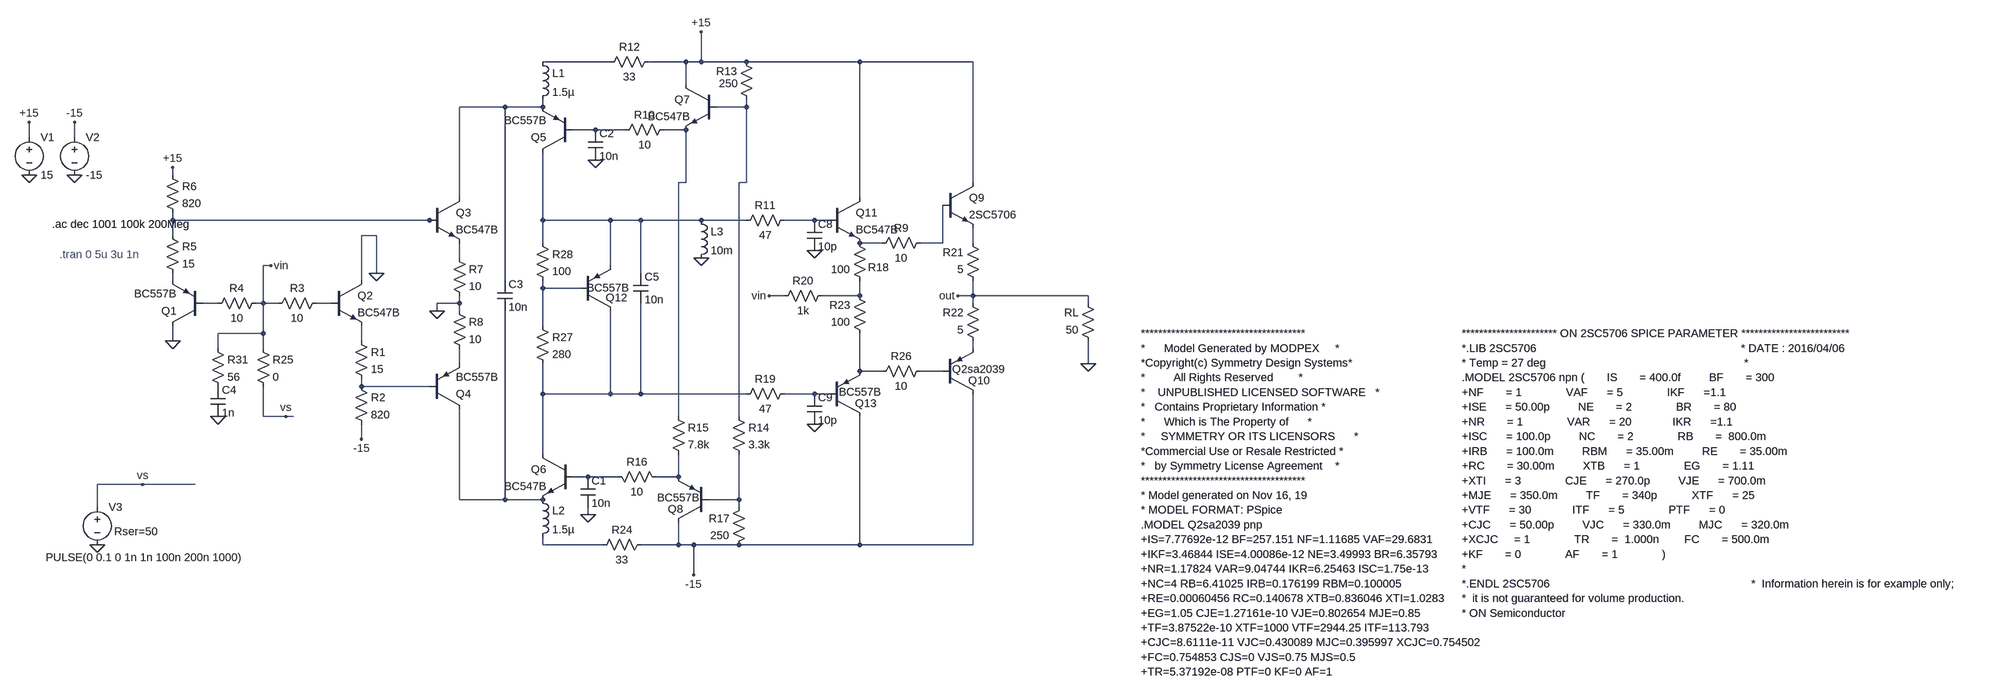
[diagram p0: schematic wideband_amp.asc]
wideband_amp.asc, the LTspice schematic file:
Version 4
SHEET 1 3884 932
WIRE 640 -304 496 -304
WIRE 800 -304 720 -304
WIRE 832 -304 832 -368
WIRE 832 -304 800 -304
WIRE 928 -304 832 -304
WIRE 1168 -304 928 -304
WIRE 1408 -304 1168 -304
WIRE 800 -256 800 -304
WIRE 416 -208 320 -208
WIRE 496 -208 496 -224
WIRE 496 -208 416 -208
WIRE 928 -208 928 -224
WIRE 928 -208 864 -208
WIRE 608 -160 560 -160
WIRE 672 -160 608 -160
WIRE 800 -160 752 -160
WIRE -592 -144 -592 -176
WIRE -496 -144 -496 -176
WIRE -288 -64 -288 -80
WIRE 800 -48 800 -160
WIRE 800 -48 784 -48
WIRE 928 -48 928 -208
WIRE 928 -48 912 -48
WIRE 1408 -48 1408 -304
WIRE 320 -16 320 -208
WIRE 1168 -16 1168 -304
WIRE -288 32 -288 16
WIRE 256 32 -288 32
WIRE 272 32 256 32
WIRE 496 32 496 -112
WIRE 640 32 496 32
WIRE 704 32 640 32
WIRE 832 32 704 32
WIRE 928 32 832 32
WIRE 1072 32 1008 32
WIRE 1104 32 1072 32
WIRE -288 64 -288 32
WIRE 144 64 112 64
WIRE 496 80 496 32
WIRE 1216 80 1168 80
WIRE 1344 80 1344 0
WIRE 1344 80 1296 80
WIRE 1408 80 1408 48
WIRE 320 112 320 80
WIRE -80 128 -96 128
WIRE 640 128 640 32
WIRE 144 144 144 64
WIRE 704 144 704 32
WIRE -288 160 -288 144
WIRE 112 160 112 64
WIRE 416 160 416 -208
WIRE 496 176 496 160
WIRE 576 176 496 176
WIRE 1008 192 976 192
WIRE 1168 192 1168 160
WIRE 1168 192 1088 192
WIRE 1408 192 1408 160
WIRE 1408 192 1376 192
WIRE 1712 192 1408 192
WIRE -192 208 -224 208
WIRE -96 208 -96 128
WIRE -96 208 -112 208
WIRE -64 208 -96 208
WIRE 48 208 16 208
WIRE 320 208 320 192
WIRE 320 208 272 208
WIRE 1408 208 1408 192
WIRE 1712 208 1712 192
WIRE 272 224 272 208
WIRE 320 224 320 208
WIRE 496 256 496 176
WIRE -96 272 -96 208
WIRE -96 272 -192 272
WIRE -288 288 -288 256
WIRE 112 288 112 256
WIRE -192 304 -192 272
WIRE -96 304 -96 272
WIRE 1408 304 1408 288
WIRE 320 336 320 304
WIRE 1712 336 1712 288
WIRE 1168 352 1168 272
WIRE 1216 352 1168 352
WIRE 1344 352 1296 352
WIRE 112 384 112 368
WIRE 256 384 112 384
WIRE 496 400 496 336
WIRE 640 400 640 224
WIRE 640 400 496 400
WIRE 704 400 704 208
WIRE 704 400 640 400
WIRE 928 400 704 400
WIRE 1072 400 1008 400
WIRE 1104 400 1072 400
WIRE -96 448 -96 384
WIRE -48 448 -96 448
WIRE -32 448 -48 448
WIRE 784 448 784 -48
WIRE 912 448 912 -48
WIRE 112 496 112 464
WIRE 496 528 496 400
WIRE 592 576 560 576
WIRE 656 576 592 576
WIRE 784 576 784 528
WIRE 784 576 736 576
WIRE -352 592 -448 592
WIRE -240 592 -352 592
WIRE 320 624 320 432
WIRE 416 624 416 224
WIRE 416 624 320 624
WIRE 496 624 416 624
WIRE 912 624 912 528
WIRE 912 624 848 624
WIRE -448 640 -448 592
WIRE 912 640 912 624
WIRE 592 656 592 640
WIRE 496 720 496 704
WIRE 624 720 496 720
WIRE 784 720 784 672
WIRE 784 720 704 720
WIRE 816 720 784 720
WIRE 912 720 816 720
WIRE 1168 720 1168 448
WIRE 1168 720 912 720
WIRE 1408 720 1408 400
WIRE 1408 720 1168 720
WIRE 816 784 816 720
FLAG -592 -64 0
FLAG -496 -64 0
FLAG -592 -176 +15
FLAG -496 -176 -15
FLAG 112 496 -15
FLAG 144 144 0
FLAG -288 288 0
FLAG -288 -80 +15
FLAG 272 224 0
FLAG 592 656 0
FLAG 832 -368 +15
FLAG 816 784 -15
FLAG 1712 336 0
FLAG 1376 192 out
FLAG 608 -96 0
FLAG -80 128 vin
FLAG -448 720 0
FLAG 1072 96 0
FLAG 1072 464 0
FLAG 832 112 0
FLAG -192 448 0
FLAG -48 448 vs
FLAG -352 592 vs
FLAG 976 192 vin
DATAFLAG -96 32 "$"
DATAFLAG 208 384 "$"
DATAFLAG 864 624 "$"
DATAFLAG 608 576 "$"
DATAFLAG 896 -208 "$"
DATAFLAG 512 720 "$"
DATAFLAG 560 -304 "$"
DATAFLAG -80 208 "$"
DATAFLAG 656 32 "$"
DATAFLAG 624 400 "$"
DATAFLAG 1264 352 "$"
SYMBOL pnp -224 256 R180
SYMATTR InstName Q1
SYMATTR Value BC557B
SYMBOL npn 48 160 R0
SYMATTR InstName Q2
SYMATTR Value BC547B
SYMBOL voltage -592 -160 R0
SYMATTR InstName V1
SYMATTR Value 15
SYMATTR SpiceLine Rser=0
SYMBOL voltage -496 -160 R0
SYMATTR InstName V2
SYMATTR Value -15
SYMBOL res 96 272 R0
SYMATTR InstName R1
SYMATTR Value 15
SYMBOL res 96 368 R0
SYMATTR InstName R2
SYMATTR Value 820
SYMBOL res 32 192 R90
WINDOW 0 0 56 VBottom 2
WINDOW 3 32 56 VTop 2
SYMATTR InstName R3
SYMATTR Value 10
SYMBOL res -96 192 R90
WINDOW 0 0 56 VBottom 2
WINDOW 3 32 56 VTop 2
SYMATTR InstName R4
SYMATTR Value 10
SYMBOL res -304 48 R0
SYMATTR InstName R5
SYMATTR Value 15
SYMBOL res -304 -80 R0
SYMATTR InstName R6
SYMATTR Value 820
SYMBOL npn 256 -16 R0
SYMATTR InstName Q3
SYMATTR Value BC547B
SYMBOL pnp 256 432 M180
SYMATTR InstName Q4
SYMATTR Value BC557B
SYMBOL res 304 96 R0
SYMATTR InstName R7
SYMATTR Value 10
SYMBOL res 304 208 R0
SYMATTR InstName R8
SYMATTR Value 10
SYMBOL pnp 560 -112 R180
SYMATTR InstName Q5
SYMATTR Value BC557B
SYMBOL npn 560 528 M0
SYMATTR InstName Q6
SYMATTR Value BC547B
SYMBOL cap 576 576 R0
SYMATTR InstName C1
SYMATTR Value 10n
SYMBOL cap 592 -160 R0
SYMATTR InstName C2
SYMATTR Value 10n
SYMBOL res 768 -176 R90
WINDOW 0 0 56 VBottom 2
WINDOW 3 32 56 VTop 2
SYMATTR InstName R10
SYMATTR Value 10
SYMBOL npn 864 -256 M0
SYMATTR InstName Q7
SYMATTR Value BC547B
SYMBOL res 736 -320 R90
WINDOW 0 0 56 VBottom 2
WINDOW 3 32 56 VTop 2
SYMATTR InstName R12
SYMATTR Value 33
SYMBOL res 944 -208 R180
WINDOW 0 36 76 Left 2
WINDOW 3 34 50 Left 2
SYMATTR InstName R13
SYMATTR Value 250
SYMBOL res 752 592 M270
WINDOW 0 32 56 VTop 2
WINDOW 3 0 56 VBottom 2
SYMATTR InstName R16
SYMATTR Value 10
SYMBOL res 928 624 M0
SYMATTR InstName R17
SYMATTR Value 250
SYMBOL pnp 848 672 R180
WINDOW 0 54 28 Left 2
WINDOW 3 20 52 Left 2
SYMATTR InstName Q8
SYMATTR Value BC557B
SYMBOL voltage -448 624 R0
WINDOW 39 36 68 Left 2
WINDOW 3 -109 123 Left 2
SYMATTR SpiceLine Rser=50
SYMATTR Value PULSE(0 0.1 0 1n 1n 100n 200n 1000)
SYMATTR InstName V3
SYMATTR Value2 AC 1
SYMBOL res 1728 304 R180
WINDOW 0 36 76 Left 2
WINDOW 3 36 40 Left 2
SYMATTR InstName RL
SYMATTR Value 50
SYMBOL res 720 704 R90
WINDOW 0 0 56 VBottom 2
WINDOW 3 32 56 VTop 2
SYMATTR InstName R24
SYMATTR Value 33
SYMBOL res 1024 16 R90
WINDOW 0 0 56 VBottom 2
WINDOW 3 32 56 VTop 2
SYMATTR InstName R11
SYMATTR Value 47
SYMBOL res 1024 384 R90
WINDOW 0 0 56 VBottom 2
WINDOW 3 32 56 VTop 2
SYMATTR InstName R19
SYMATTR Value 47
SYMBOL res 1104 176 R90
WINDOW 0 0 56 VBottom 2
WINDOW 3 32 56 VTop 2
SYMATTR InstName R20
SYMATTR Value 1k
SYMBOL cap 400 160 R0
SYMATTR InstName C3
SYMATTR Value 10n
SYMBOL res 896 432 R0
SYMATTR InstName R14
SYMATTR Value 3.3k
SYMBOL res 768 432 R0
SYMATTR InstName R15
SYMATTR Value 7.8k
SYMBOL ind 480 -320 R0
SYMATTR InstName L1
SYMATTR Value 1.5µ
SYMBOL ind 480 608 R0
SYMATTR InstName L2
SYMATTR Value 1.5µ
SYMBOL npn 1104 -16 R0
SYMATTR InstName Q11
SYMATTR Value BC547B
SYMBOL pnp 1104 448 M180
WINDOW 0 54 28 Left 2
WINDOW 3 20 52 Left 2
SYMATTR InstName Q13
SYMATTR Value BC557B
SYMBOL res 1184 176 R180
WINDOW 0 -46 44 Left 2
WINDOW 3 36 40 Left 2
SYMATTR InstName R18
SYMATTR Value 100
SYMBOL res 1184 288 R180
WINDOW 0 36 76 Left 2
WINDOW 3 36 40 Left 2
SYMATTR InstName R23
SYMATTR Value 100
SYMBOL npn 1344 -48 R0
SYMATTR InstName Q9
SYMATTR Value 2SC5706
SYMBOL pnp 1344 400 M180
WINDOW 0 54 28 Left 2
WINDOW 3 20 52 Left 2
SYMATTR InstName Q10
SYMATTR Value Q2sa2039
SYMBOL res 1424 176 R180
WINDOW 0 36 76 Left 2
WINDOW 3 36 40 Left 2
SYMATTR InstName R21
SYMATTR Value 5
SYMBOL res 1424 304 R180
WINDOW 0 36 76 Left 2
WINDOW 3 36 40 Left 2
SYMATTR InstName R22
SYMATTR Value 5
SYMBOL pnp 576 224 M180
WINDOW 0 54 28 Left 2
WINDOW 3 14 49 Left 2
SYMATTR InstName Q12
SYMATTR Value BC557B
SYMBOL res 480 240 R0
SYMATTR InstName R27
SYMATTR Value 280
SYMBOL res 480 64 R0
SYMATTR InstName R28
SYMATTR Value 100
SYMBOL cap 688 144 R0
SYMATTR InstName C5
SYMATTR Value 10n
SYMBOL res -112 288 R0
SYMATTR InstName R25
SYMATTR Value 0
SYMBOL cap 1056 32 R0
SYMATTR InstName C8
SYMATTR Value 10p
SYMBOL cap 1056 400 R0
SYMATTR InstName C9
SYMATTR Value 10p
SYMBOL ind 816 16 R0
SYMATTR InstName L3
SYMATTR Value 10m
SYMBOL res -208 288 R0
SYMATTR InstName R31
SYMATTR Value 56
SYMBOL cap -208 384 R0
SYMATTR InstName C4
SYMATTR Value 1n
SYMBOL res 1312 64 R90
WINDOW 0 0 56 VBottom 2
WINDOW 3 32 56 VTop 2
SYMATTR InstName R9
SYMATTR Value 10
SYMBOL res 1312 336 R90
WINDOW 0 0 56 VBottom 2
WINDOW 3 32 56 VTop 2
SYMATTR InstName R26
SYMATTR Value 10
TEXT -544 40 Left 2 !.ac dec 1001 100k 200Meg
TEXT -528 104 Left 2 ;.tran 0 5u 3u 1n
TEXT 1824 272 Left 2 !**************************************\n*      Model Generated by MODPEX     *\n*Copyright(c) Symmetry Design Systems*\n*         All Rights Reserved        *\n*    UNPUBLISHED LICENSED SOFTWARE   *\n*   Contains Proprietary Information *\n*      Which is The Property of      *\n*     SYMMETRY OR ITS LICENSORS      *\n*Commercial Use or Resale Restricted *\n*   by Symmetry License Agreement    *\n**************************************\n* Model generated on Nov 16, 19\n* MODEL FORMAT: PSpice\n.MODEL Q2sa2039 pnp\n+IS=7.77692e-12 BF=257.151 NF=1.11685 VAF=29.6831\n+IKF=3.46844 ISE=4.00086e-12 NE=3.49993 BR=6.35793\n+NR=1.17824 VAR=9.04744 IKR=6.25463 ISC=1.75e-13\n+NC=4 RB=6.41025 IRB=0.176199 RBM=0.100005\n+RE=0.00060456 RC=0.140678 XTB=0.836046 XTI=1.0283\n+EG=1.05 CJE=1.27161e-10 VJE=0.802654 MJE=0.85\n+TF=3.87522e-10 XTF=1000 VTF=2944.25 ITF=113.793\n+CJC=8.6111e-11 VJC=0.430089 MJC=0.395997 XCJC=0.754502\n+FC=0.754853 CJS=0 VJS=0.75 MJS=0.5\n+TR=5.37192e-08 PTF=0 KF=0 AF=1
TEXT 2504 272 Left 2 !********************** ON 2SC5706 SPICE PARAMETER *************************\n*.LIB 2SC5706                                                                 * DATE : 2016/04/06                                                           \n* Temp = 27 deg                                                               *                                                                             \n.MODEL 2SC5706 npn (       IS       = 400.0f         BF       = 300           \n+NF       = 1              VAF      = 5              IKF      =1.1            \n+ISE      = 50.00p         NE       = 2              BR       = 80            \n+NR       = 1              VAR      = 20             IKR      =1.1            \n+ISC      = 100.0p         NC       = 2              RB       =  800.0m       \n+IRB      = 100.0m         RBM      = 35.00m         RE       = 35.00m        \n+RC       = 30.00m         XTB      = 1              EG       = 1.11          \n+XTI      = 3              CJE      = 270.0p         VJE      = 700.0m        \n+MJE      = 350.0m         TF       = 340p           XTF      = 25            \n+VTF      = 30             ITF      = 5              PTF      = 0             \n+CJC      = 50.00p         VJC      = 330.0m         MJC      = 320.0m        \n+XCJC     = 1              TR       =  1.000n        FC       = 500.0m        \n+KF       = 0              AF       = 1              )                        \n*                                                                             \n*.ENDL 2SC5706                                                                *  Information herein is for example only;                                    \n*  it is not guaranteed for volume production.                                \n* ON Semiconductor

The netlist it stands for:
* wideband_amp.asc
Q1 0 N016 N013 0 BC557B
Q2 0 N017 N018 0 BC547B
V1 +15 0 15 Rser=0
V2 -15 0 -15
R1 N018 N023 15
R2 N023 -15 820
R3 N017 vin 10
R4 vin N016 10
R5 N006 N013 15
R6 +15 N006 820
Q3 N002 N006 N012 0 BC547B
Q4 N028 N023 N020 0 BC557B
R7 N012 0 10
R8 0 N020 10
Q5 N007 N004 N002 0 BC557B
Q6 N024 N026 N028 0 BC547B
C1 N026 0 10n
C2 N004 0 10n
R10 N005 N004 10
Q7 +15 N003 N005 0 BC547B
R12 +15 N001 33
R13 N003 +15 250
R16 N027 N026 10
R17 N029 -15 250
Q8 -15 N029 N027 0 BC557B
V3 vs 0 PULSE(0 0.1 0 1n 1n 100n 200n 1000) AC 1 Rser=50
RL 0 out 50
R24 -15 N030 33
R11 N008 N007 47
R19 N025 N024 47
R20 N015 vin 1k
C3 N002 N028 10n
R14 N003 N029 3.3k
R15 N005 N027 7.8k
L1 N001 N002 1.5µ
L2 N028 N030 1.5µ
Q11 +15 N008 N009 0 BC547B
Q13 -15 N025 N021 0 BC557B
R18 N015 N009 100
R23 N021 N015 100
Q9 +15 N010 N011 0 2SC5706
Q10 -15 N022 N019 0 Q2sa2039
R21 out N011 5
R22 N019 out 5
Q12 N024 N014 N007 0 BC557B
R27 N014 N024 280
R28 N007 N014 100
C5 N007 N024 10n
R25 vin vs 0
C8 N008 0 10p
C9 N025 0 10p
L3 N007 0 10m
R31 vin P001 56
C4 P001 0 1n
R9 N010 N009 10
R26 N022 N021 10
.model NPN NPN
.model PNP PNP
.lib standard.bjt
.ac dec 1001 100k 200Meg
* .tran 0 5u 3u 1n
**************************************
*      Model Generated by MODPEX     *
*Copyright(c) Symmetry Design Systems*
*         All Rights Reserved        *
*    UNPUBLISHED LICENSED SOFTWARE   *
*   Contains Proprietary Information *
*      Which is The Property of      *
*     SYMMETRY OR ITS LICENSORS      *
*Commercial Use or Resale Restricted *
*   by Symmetry License Agreement    *
**************************************
* Model generated on Nov 16, 19
* MODEL FORMAT: PSpice
.MODEL Q2sa2039 pnp
+IS=7.77692e-12 BF=257.151 NF=1.11685 VAF=29.6831
+IKF=3.46844 ISE=4.00086e-12 NE=3.49993 BR=6.35793
+NR=1.17824 VAR=9.04744 IKR=6.25463 ISC=1.75e-13
+NC=4 RB=6.41025 IRB=0.176199 RBM=0.100005
+RE=0.00060456 RC=0.140678 XTB=0.836046 XTI=1.0283
+EG=1.05 CJE=1.27161e-10 VJE=0.802654 MJE=0.85
+TF=3.87522e-10 XTF=1000 VTF=2944.25 ITF=113.793
+CJC=8.6111e-11 VJC=0.430089 MJC=0.395997 XCJC=0.754502
+FC=0.754853 CJS=0 VJS=0.75 MJS=0.5
+TR=5.37192e-08 PTF=0 KF=0 AF=1
********************** ON 2SC5706 SPICE PARAMETER *************************
*.LIB 2SC5706                                                                 * DATE : 2016/04/06
* Temp = 27 deg                                                               *
.MODEL 2SC5706 npn (       IS       = 400.0f         BF       = 300
+NF       = 1              VAF      = 5              IKF      =1.1
+ISE      = 50.00p         NE       = 2              BR       = 80
+NR       = 1              VAR      = 20             IKR      =1.1
+ISC      = 100.0p         NC       = 2              RB       =  800.0m
+IRB      = 100.0m         RBM      = 35.00m         RE       = 35.00m
+RC       = 30.00m         XTB      = 1              EG       = 1.11
+XTI      = 3              CJE      = 270.0p         VJE      = 700.0m
+MJE      = 350.0m         TF       = 340p           XTF      = 25
+VTF      = 30             ITF      = 5              PTF      = 0
+CJC      = 50.00p         VJC      = 330.0m         MJC      = 320.0m
+XCJC     = 1              TR       =  1.000n        FC       = 500.0m
+KF       = 0              AF       = 1              )
*
*.ENDL 2SC5706                                                                *  Information herein is for example only;
*  it is not guaranteed for volume production.
* ON Semiconductor
.backanno
.end